# EAGLE design NitroxAnalyzer (EAGLE 7.3.0)
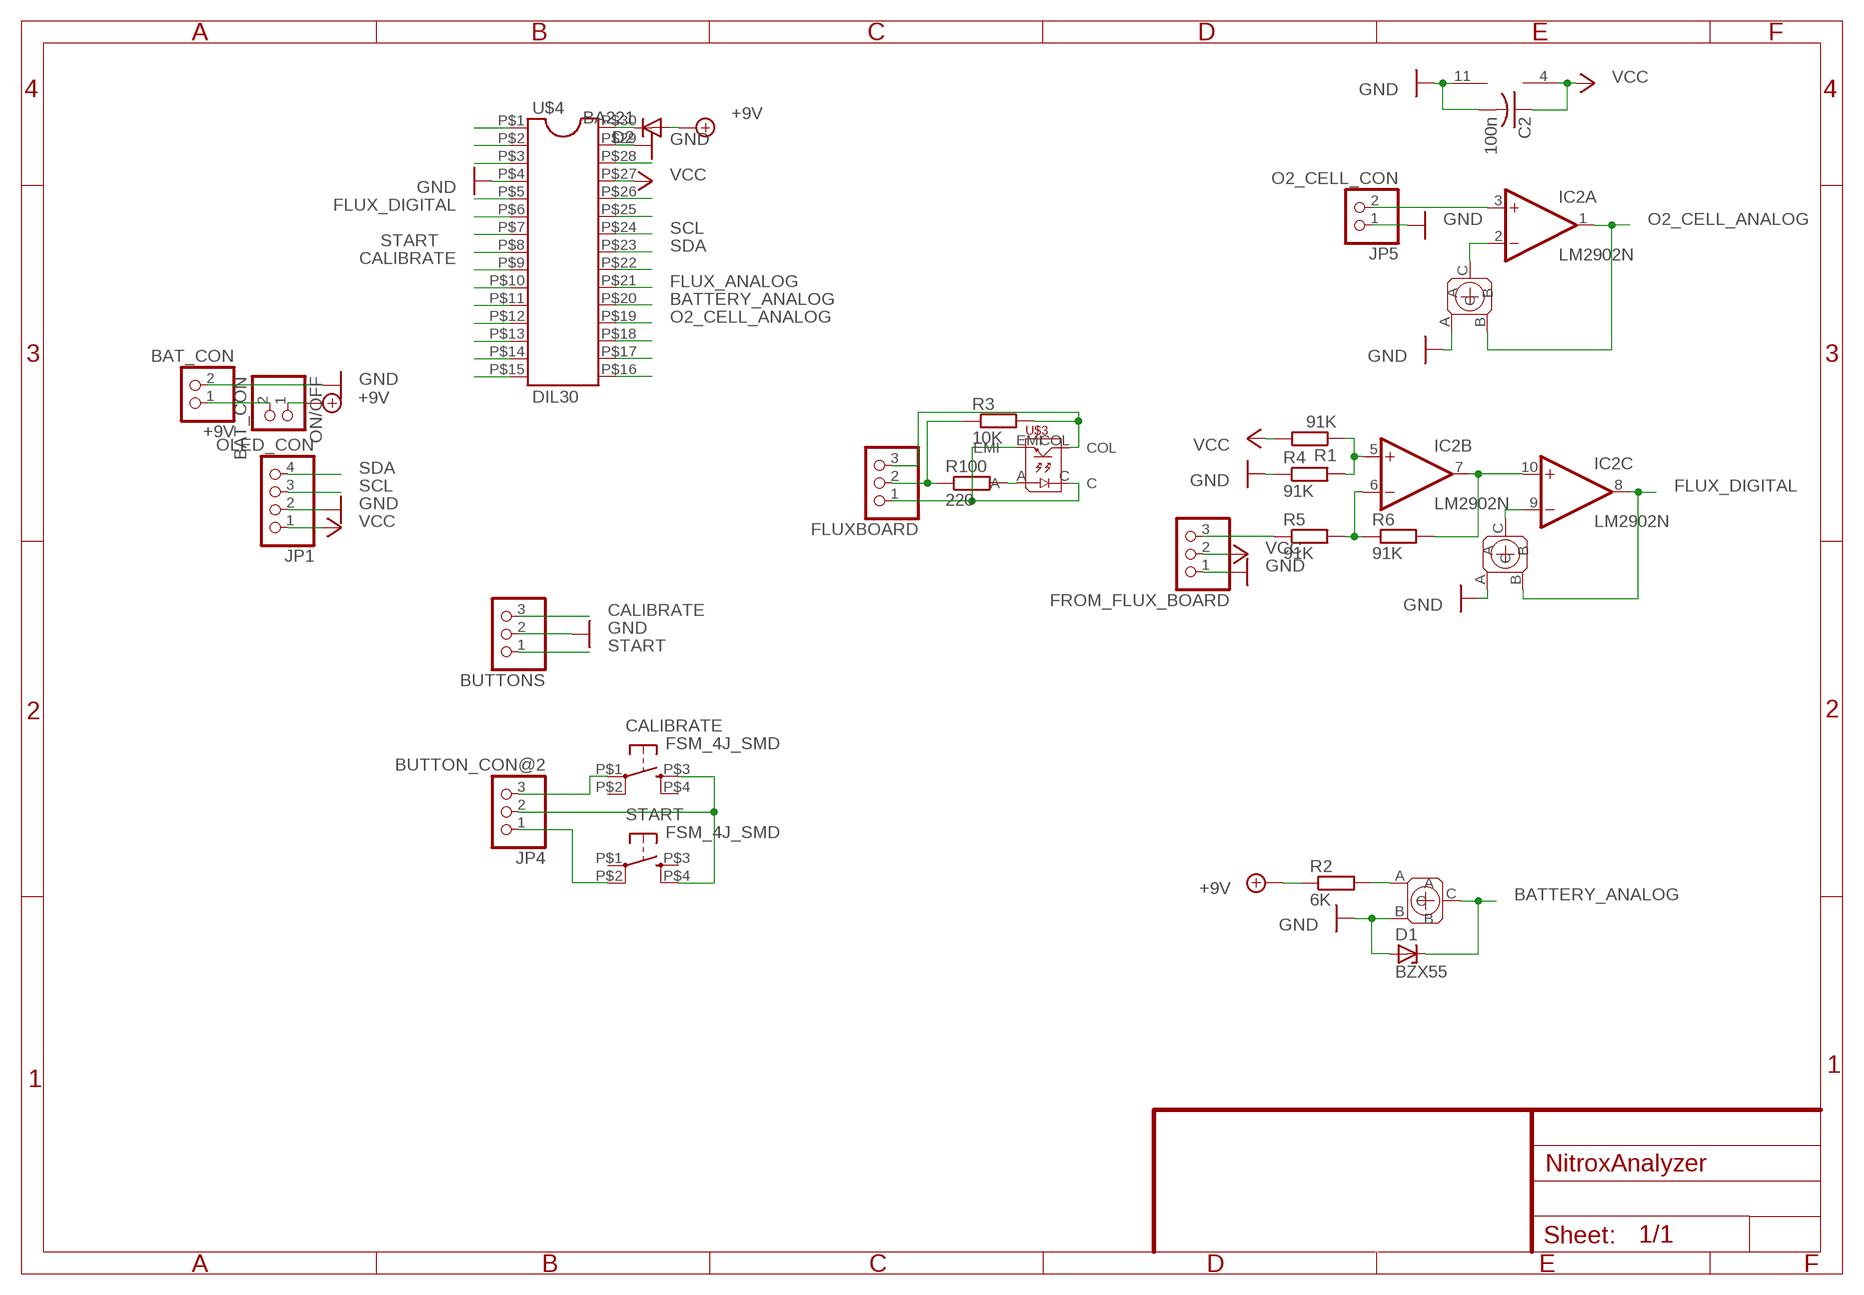
[diagram p0: schematic, sheet 1]

## Parts
+9V  BAT_CON  PINHD-1X2  [1X02]
BUTTONS  PINHD-1X3  [1X03]
C2  100n  C-USC1206  [C1206]
CALIBRATE  FSM_4J_SMD  [B3F-10XX]
D1  BZX55  [DO35Z10]
D2  BA221  [DO35-10]
FLUXBOARD  PINHD-1X3  [1X03]
FROM_FLUX_BOARD  PINHD-1X3  [1X03]
IC2  LM2902N  [DIL14]
JP1  OLED_CON  PINHD-1X4  [1X04]
JP4  BUTTON_CON@2  PINHD-1X3  [1X03]
JP5  O2_CELL_CON  PINHD-1X2  [1X02]
ON/OFF  BAT_CON  PINHD-1X2  [1X02]
R1  91K  R-EU_R0805  [R0805]
R2  6K  R-EU_R1206  [R1206]
R3  10K  R-EU_R1206  [R1206]
R4  91K  R-EU_R0805  [R0805]
R5  91K  R-EU_R0805  [R0805]
R6  91K  R-EU_R0805  [R0805]
R100  220  R-EU_R1206  [R1206]
START  FSM_4J_SMD  [B3F-10XX]
U$1  10K  PT6KV  [PT6KV]
U$2  100K  PT6KV  [PT6KV]
U$3  ITR8307  [4PIN]
U$4  DIL30  [DIL30]
U$5  100K  PT6KV  [PT6KV]

## Nets
+9V: D2.A ON/OFF.1 R2.1
BATTERY_ANALOG: D1.C U$1.C U$4.P$20
CALIBRATE: BUTTONS.3 U$4.P$8
FLUX_ANALOG: U$4.P$21
FLUX_DIGITAL: IC2.8(C:OUT) U$4.P$5 U$5.B
GND: +9V.2 BUTTONS.2 C2.2 D1.A FROM_FLUX_BOARD.1 IC2.11(P:V-) JP1.2 JP5.1 R4.1 U$1.B U$2.A U$4.P$4 U$4.P$29 U$5.A
GND_: FLUXBOARD.1 U$3.C U$3.EMI
N$1: R100.2 U$3.A
N$2: U$4.P$1
N$3: IC2.2(A:-IN) U$2.C
N$4: CALIBRATE.P$1(P) JP4.3
N$5: +9V.1 ON/OFF.2
N$6: JP4.1 START.P$2(P1)
N$7: U$4.P$2
N$8: CALIBRATE.P$3(S) JP4.2 START.P$4(S1)
N$9: U$4.P$3
N$10: D2.C U$4.P$30
N$11: U$4.P$6
N$12: U$4.P$9
N$13: U$4.P$10
N$14: U$4.P$11
N$15: U$4.P$12
N$16: U$4.P$13
N$17: U$4.P$14
N$18: U$4.P$15
N$19: U$4.P$16
N$20: U$4.P$17
N$21: U$4.P$18
N$22: U$4.P$22
N$23: U$4.P$25
N$24: U$4.P$26
N$25: U$4.P$28
N$26: R2.2 U$1.A
N$28: IC2.7(B:OUT) IC2.10(C:+IN) R6.2
N$29: IC2.6(B:-IN) R5.2 R6.1
N$30: FROM_FLUX_BOARD.3 R5.1
N$31: IC2.5(B:+IN) R1.1 R4.2
N$32: IC2.9(C:-IN) U$5.C
N$33: IC2.3(A:+IN) JP5.2
O2_CELL_ANALOG: IC2.1(A:OUT) U$2.B U$4.P$19
SCL: JP1.3 U$4.P$24
SDA: JP1.4 U$4.P$23
SIG: FLUXBOARD.3 R3.2 U$3.COL
START: BUTTONS.1 U$4.P$7
VCC: C2.1 FROM_FLUX_BOARD.2 IC2.4(P:V+) JP1.1 R1.2 U$4.P$27
VCC_: FLUXBOARD.2 R3.1 R100.1
Unconnected: CALIBRATE.P$2(P1) CALIBRATE.P$4(S1) IC2.12(D:+IN) IC2.13(D:-IN) IC2.14(D:OUT) START.P$1(P) START.P$3(S)

## Library data of the parts
+9V JP5 ON/OFF = pinhead:PINHD-1X2: PIN HEADER
BUTTONS FLUXBOARD FROM_FLUX_BOARD JP4 = pinhead:PINHD-1X3: PIN HEADER
C2 = rcl:C-US: CAPACITOR, American symbol
CALIBRATE START = FSM_4J:FSM_4J_SMD
D1 = diode:BZX55: Z DIODE
D2 = diode:BA221: DIODE high speed (Philips)
IC2 = linear:LM2902: COMPARATOR
JP1 = pinhead:PINHD-1X4: PIN HEADER
R1-R6 R100 = rcl:R-EU_: RESISTOR, European symbol
U$1 U$2 U$5 = piher:PT6KV
U$3 = ITR8307:ITR8307
U$4 = ic-package:DIL30

## Board
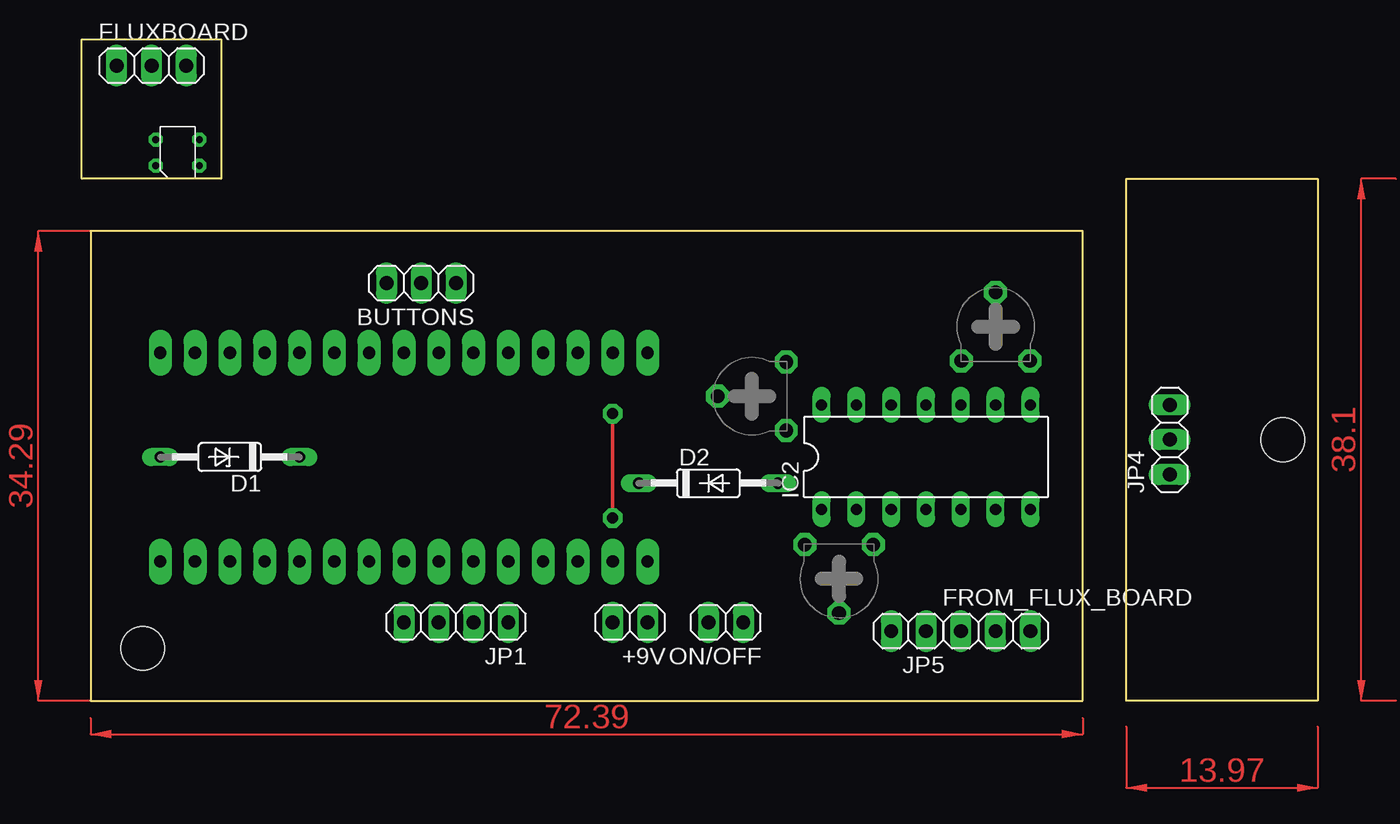
[diagram p1: board, top side]
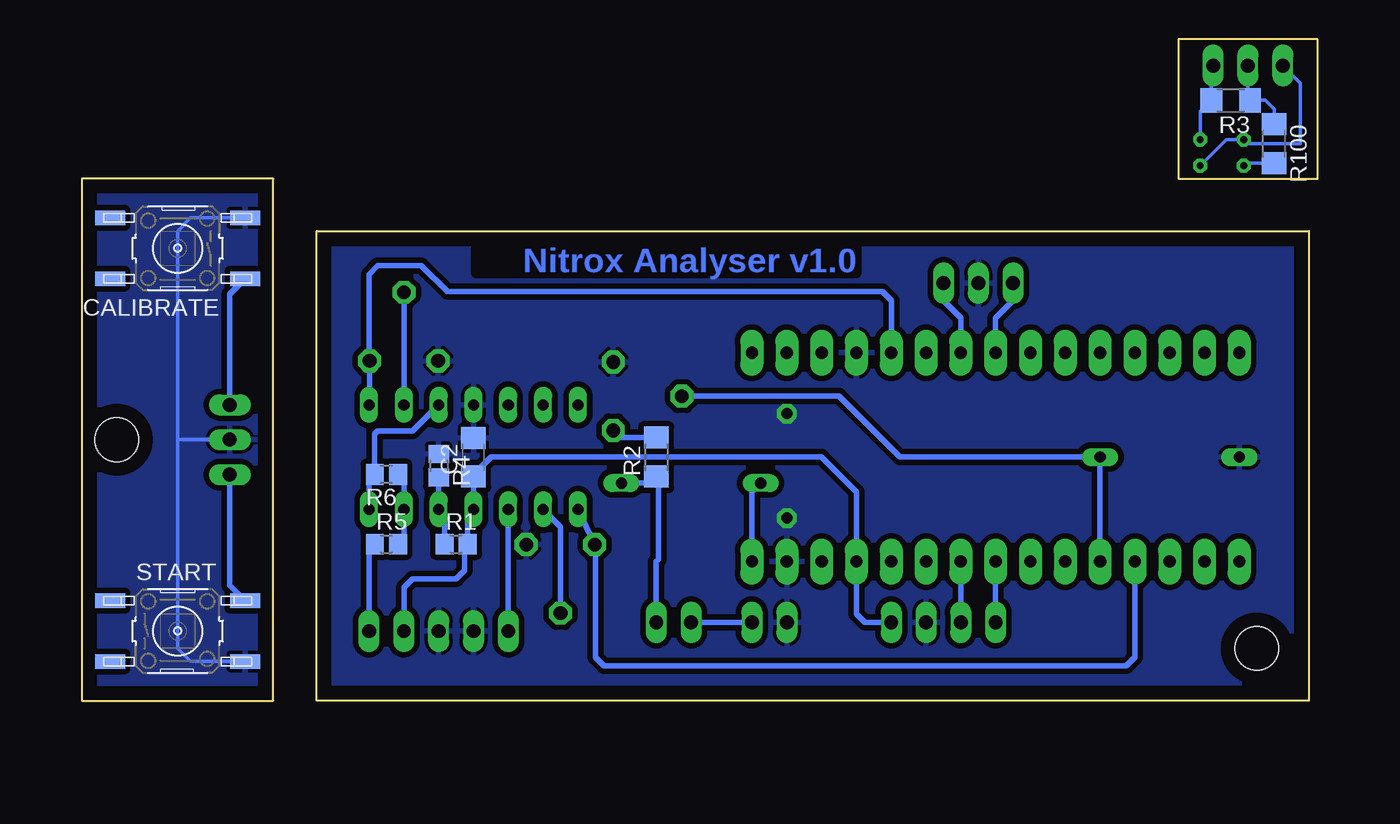
[diagram p2: board, bottom side, seen from below]

Size 90.17 x 48.26 mm. Coordinates in mm from the lower left corner, seen from the top.
Outline: 76.2,0 76.2,38.1 90.17,38.1 90.17,0 76.2,0
Outline: 73.03,0 73.03,34.29 0.64,34.29 0.64,0 73.03,0
Outline: 0,38.1 0,48.26 10.16,48.26 10.16,38.1 0,38.1
Copper layers (1*16): Top 0.035mm / dielectric 1.5mm / Bottom 0.035mm
Design rules "default *": minimum track width 10mil, minimum drill 24mil, track to track 16mil, track to pad 16mil, pad to pad 16mil, via to via 16mil, smd to smd 8mil, copper to edge 40mil, drill to drill 8mil, minimum pad ring 10mil, minimum via ring 8mil, stop-mask expansion 4mil, vias tented up to drill 0mil, thermal gap 10mil
Holes 3.2 mm at 87.63,19.05 4.45,3.81

### Footprints (pad centres in the part's own frame; a part is rotated, then mirrored left to right if it is on the bottom)
1X02 = drill 1.016 long: 1 -1.27,0; 2 1.27,0
1X03 = drill 1.016 long: 1 -2.54,0; 2 0,0; 3 2.54,0
C1206 = smd 1.6 x 1.8: 1 -1.4,0; 2 1.4,0
B3F-10XX = smd 2.184 x 1.067: P$1 -4.921,2.223; P$2 4.921,2.223; P$3 -4.921,-2.223; P$4 4.921,-2.223
DO35Z10 = drill 0.813 long: A 5.08,0; C -5.08,0
DO35-10 = drill 0.813 long: A 5.08,0; C -5.08,0
DIL14 = drill 0.813 long: 1 -7.62,-3.81; 2 -5.08,-3.81; 3 -2.54,-3.81; 4 0,-3.81; 5 2.54,-3.81; 6 5.08,-3.81; 7 7.62,-3.81; 8 7.62,3.81; 9 5.08,3.81; 10 2.54,3.81; 11 0,3.81; 12 -2.54,3.81; 13 -5.08,3.81; 14 -7.62,3.81
1X04 = drill 1.016 long: 1 -3.81,0; 2 -1.27,0; 3 1.27,0; 4 3.81,0
R0805 = smd 1.3 x 1.5: 1 -0.85,0; 2 0.85,0
R1206 = smd 1.6 x 1.803: 1 -1.422,0; 2 1.422,0
PT6KV = drill 1 pad 1.676 octagon: A -2.5,-2.5; B 2.5,-2.5; C 0,2.5
4PIN = drill 0.5 pad 1.016 octagon: A -1.587,-0.953; C 1.587,-0.953; COL 1.587,0.953; EMI -1.587,0.953
DIL30 = drill 0.9 pad 1.676 long: P$1 -7.62,17.78; P$2 -7.62,15.24; P$3 -7.62,12.7; P$4 -7.62,10.16; P$5 -7.62,7.62; P$6 -7.62,5.08; P$7 -7.62,2.54; P$8 -7.62,0; P$9 -7.62,-2.54; P$10 -7.62,-5.08; P$11 -7.62,-7.62; P$12 -7.62,-10.16; P$13 -7.62,-12.7; P$14 -7.62,-15.24; P$15 -7.62,-17.78; P$16 7.62,-17.78; P$17 7.62,-15.24; P$18 7.62,-12.7; P$19 7.62,-10.16; P$20 7.62,-7.62; P$21 7.62,-5.08; P$22 7.62,-2.54; P$23 7.62,0; P$24 7.62,2.54; P$25 7.62,5.08; P$26 7.62,7.62; P$27 7.62,10.16; P$28 7.62,12.7; P$29 7.62,15.24; P$30 7.62,17.78

### Placement (x,y rotation side)
+9V  40,5.71 180 top
BUTTONS  24.77,30.48 180 top
C2  61.59,17.78 90 bottom
CALIBRATE  83.19,33.02 180 bottom
D1  10.79,17.78 180 top
D2  45.72,15.88 0 top
FLUXBOARD  5.08,46.35 0 top
FROM_FLUX_BOARD  66.68,5.08 0 top
IC2  61.59,17.78 0 top
JP1  27.31,5.71 180 top
JP4  79.38,19.05 90 top
JP5  60.32,5.08 180 top
ON/OFF  46.99,5.71 180 top
R1  62.86,11.43 0 bottom
R2  48.26,17.78 90 bottom
R3  6.35,43.81 180 bottom
R4  64.14,17.14 270 bottom
R5  67.95,11.43 0 bottom
R6  67.95,16.51 180 bottom
R100  3.17,40.64 270 bottom
START  83.19,5.08 0 bottom
U$1  48.89,22.23 90 top
U$2  55.24,8.89 180 top
U$3  6.98,40.01 0 top
U$4  23.5,17.78 270 top
U$5  66.68,27.3 0 top

### Tracks (layer width: path | path; a pad name or v marks a point on that pad's centre or on a via)
+9V
  Bottom 0.4: 48.11,10.31 48.11,15.88 | 48.11,15.88 48.11,16.21 R2.1 | D2.A 48.11,15.88
  Bottom 0.406: 48.11,10.31 48.26,10.16 ON/OFF.1
BATTERY_ANALOG
  Bottom 0.406: U$4.P$20 D1.C 30.48,17.78 34.92,22.23 U$1.C
CALIBRATE
  Bottom 0.406: BUTTONS.3 22.23,29.21 23.5,27.94 U$4.P$8
FLUX_DIGITAL
  Bottom 0.406: IC2.8 69.18,21.63 U$5.B 69.22,24.84 69.22,31.11 68.58,31.75 65.41,31.75 63.5,29.84 31.75,29.84 31.12,29.21 U$4.P$5
GND  (via drill 0.8 pad 1.42)
  Top 0.254: v38.73,13.34 v38.73,20.95
  pour Bottom: 0,0 73.66,0 73.66,34.92 0,34.92
GND_
  Bottom 0.254: FLUXBOARD.1 1.27,45.09 1.27,40.64 5.08,40.64 U$3.EMI 6.67,40.96 U$3.C
N$1
  Bottom 0.254: R100.2 5.23,39.22 U$3.A
N$3
  Bottom 0.406: IC2.2 55.24,12.7 U$2.C
N$4
  Bottom 0.254: 78.11,30.48 78.42,30.8 CALIBRATE.P$1
  Bottom 0.406: JP4.3 79.38,29.69 CALIBRATE.P$1
N$5
  Bottom 0.406: ON/OFF.2 +9V.1
N$6
  Bottom 0.254: 78.11,7.62 78.42,7.3 START.P$2
  Bottom 0.406: JP4.1 79.38,8.41 START.P$2
N$8
  Bottom 0.254: 83.19,19.05 83.19,3.81 82.23,2.86 START.P$4 | 83.19,19.05 83.19,34.29 82.23,35.24 CALIBRATE.P$3 | JP4.2 83.19,19.05
  pour Bottom: 75.57,38.73 75.57,-0.64 90.81,-0.64 90.81,38.73
N$10
  Bottom 0.4: U$4.P$30 41.27,15.24 D2.C
N$26
  Bottom 0.4: R2.2 50.87,19.2 U$1.A
N$28
  Bottom 0.406: IC2.7 69.22,16.51 R6.2 68.8,19.47 68.58,19.68 66.04,19.68 IC2.10
N$29
  Bottom 0.406: R6.1 66.68,16.09 IC2.6 66.68,11.43 R5.2
N$30
  Bottom 0.406: FROM_FLUX_BOARD.3 69.22,11.01 R5.1
N$31
  Bottom 0.406: R1.1 63.71,13.55 IC2.5 R4.2
N$32
  Bottom 0.406: U$5.C IC2.9
N$33
  Bottom 0.406: IC2.3 JP5.2
O2_CELL_ANALOG
  Bottom 0.406: IC2.1 U$2.B 52.7,11.35 52.7,3.17 52.07,2.54 13.97,2.54 13.33,3.17 U$4.P$19
SCL
  Bottom 0.406: JP1.3 U$4.P$24
SDA
  Bottom 0.406: JP1.4 U$4.P$23
SIG
  Bottom 0.254: U$3.COL 8.57,43.01 R3.2 7.77,46.2 FLUXBOARD.3
START
  Bottom 0.406: BUTTONS.1 27.31,29.21 26.04,27.94 U$4.P$7
VCC
  Bottom 0.406: JP1.1 33.02,5.71 33.66,6.35 U$4.P$27 33.66,15.24 36.2,17.78 60.32,17.78 61.59,16.51 IC2.4 | IC2.4 C2.1 61.73,16.51 | IC2.4 62.02,13.55 R1.2 62.23,11.21 62.23,9.53 62.86,8.89 66.04,8.89 66.68,8.26 FROM_FLUX_BOARD.2
VCC_
  Bottom 0.254: FLUXBOARD.2 5.08,43.97 R3.1 3.81,43.81 3.17,43.18 R100.1
(copper drawn outside any net)
  shapes: Top area x4

### Text on the board
Bottom: Nitrox Analyser v1.0
bDocu: START